# EAGLE design zxuno (EAGLE 7.3.0)
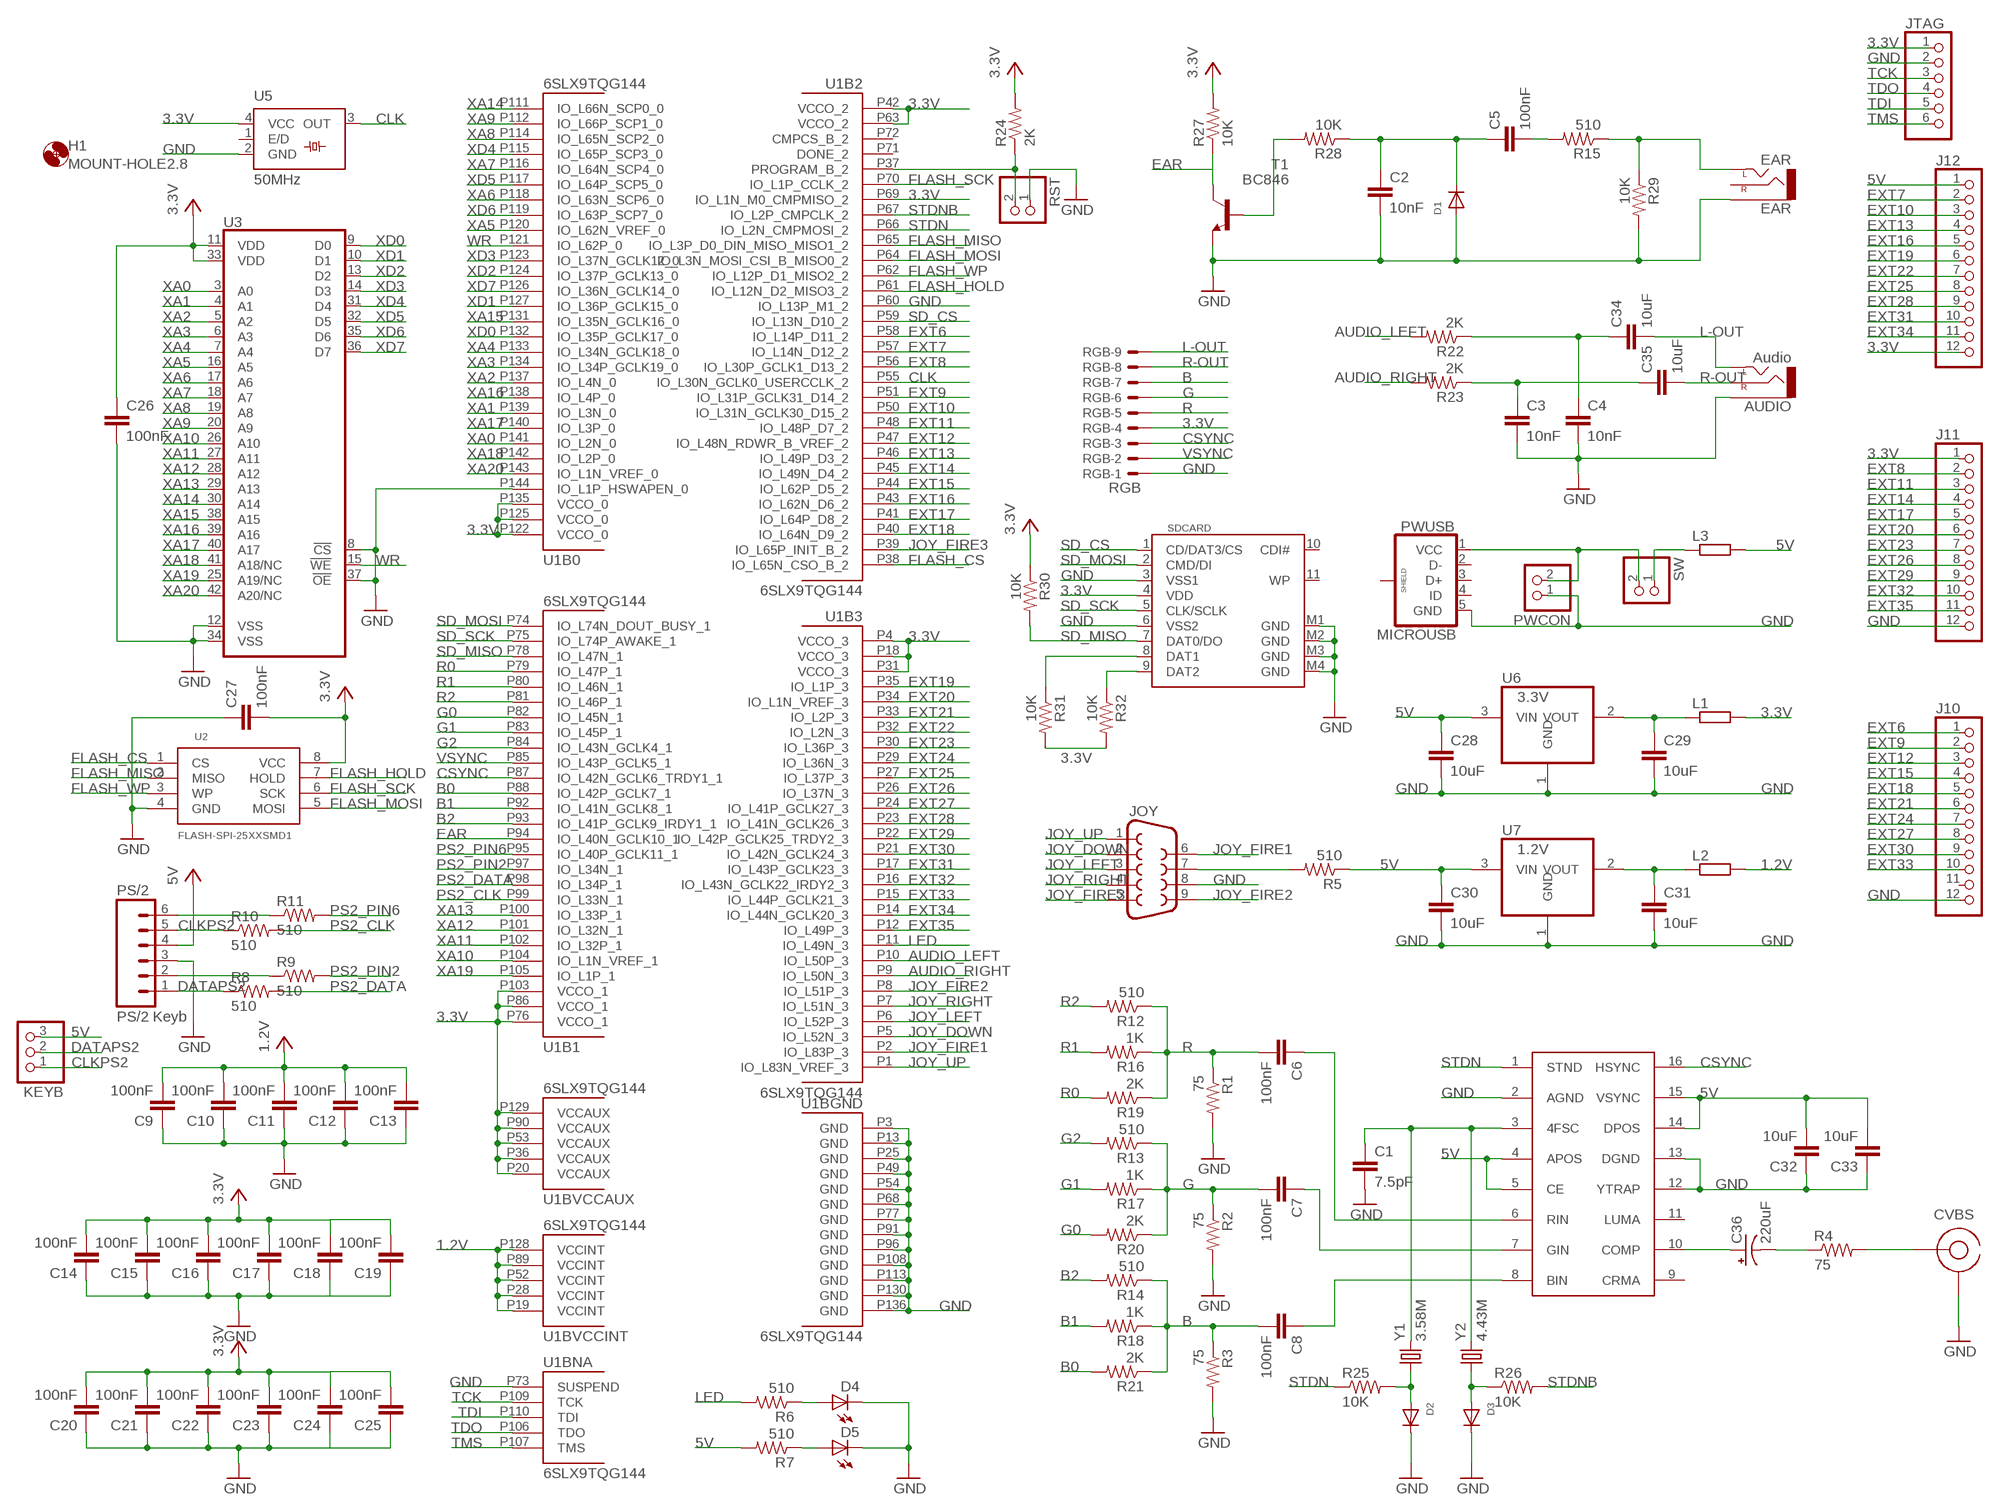
[diagram p0: schematic, sheet 1]

## Parts
AUDIO  Audio  AUDIO-JACKPTH  [AUDIO-JACK]
C1  7.5pF  C-EUC0805  [C0805]
C2  10nF  C-EUC0805  [C0805]
C3  10nF  C-EUC0805  [C0805]
C4  10nF  C-EUC0805  [C0805]
C5  100nF  C-EUC0603  [C0603]
C6  100nF  C-EUC0603  [C0603]
C7  100nF  C-EUC0603  [C0603]
C8  100nF  C-EUC0603  [C0603]
C9  100nF  C-EUC0603  [C0603]
C10  100nF  C-EUC0603  [C0603]
C11  100nF  C-EUC0603  [C0603]
C12  100nF  C-EUC0603  [C0603]
C13  100nF  C-EUC0603  [C0603]
C14  100nF  C-EUC0603  [C0603]
C15  100nF  C-EUC0603  [C0603]
C16  100nF  C-EUC0603  [C0603]
C17  100nF  C-EUC0603  [C0603]
C18  100nF  C-EUC0603  [C0603]
C19  100nF  C-EUC0603  [C0603]
C20  100nF  C-EUC0603  [C0603]
C21  100nF  C-EUC0603  [C0603]
C22  100nF  C-EUC0603  [C0603]
C23  100nF  C-EUC0603  [C0603]
C24  100nF  C-EUC0603  [C0603]
C25  100nF  C-EUC0603  [C0603]
C26  100nF  C-EUC0603  [C0603]
C27  100nF  C-EUC0603  [C0603]
C28  10uF  C-EUC0805  [C0805]
C29  10uF  C-EUC0805  [C0805]
C30  10uF  C-EUC0805  [C0805]
C31  10uF  C-EUC0805  [C0805]
C32  10uF  C-EUC0805  [C0805]
C33  10uF  C-EUC0805  [C0805]
C34  10uF  C-EUC0805  [C0805]
C35  10uF  C-EUC0805  [C0805]
C36  220uF  CPOL-US153CLV-0605  [153CLV-0605]
CVBS  RCA  [RCA]
D1  DIODESOD-323F  [SOD-323F]
D2  DIODESOD-323F  [SOD-323F]
D3  DIODESOD-323F  [SOD-323F]
D4  LEDCHIP-LED0805  [CHIP-LED0805]
D5  LEDCHIP-LED0805  [CHIP-LED0805]
EAR  EAR  AUDIO-JACKPTH  [AUDIO-JACK]
H1  MOUNT-HOLE2.8  [2,8]
J10  PINHD-1X12  [1X12]
J11  PINHD-1X12  [1X12]
J12  PINHD-1X12  [1X12]
JOY  DB9MALE  [DB9_MALE]
JTAG  PINHD-1X6  [1X06]
KEYB  PINHD-1X3  [1X03]
L1  R-EU_M0805  [M0805]
L2  R-EU_M0805  [M0805]
L3  R-EU_M0805  [M0805]
PS/2  PS/2 Keyb  DINC_MIN_TM_6_1  [DINC/MIN_TM/6_1PRIMARY]
PWCON  PINHD-1X2  [1X02]
PWUSB  MICROUSB  [MICRO_USB_1PRIMARY]
R1  75  R-US_M0805  [M0805]
R2  75  R-US_M0805  [M0805]
R3  75  R-US_M0805  [M0805]
R4  75  R-US_M0805  [M0805]
R5  510  R-US_M0805  [M0805]
R6  510  R-US_M0805  [M0805]
R7  510  R-US_M0805  [M0805]
R8  510  R-US_M0805  [M0805]
R9  510  R-US_M0805  [M0805]
R10  510  R-US_M0805  [M0805]
R11  510  R-US_M0805  [M0805]
R12  510  R-US_M0805  [M0805]
R13  510  R-US_M0805  [M0805]
R14  510  R-US_M0805  [M0805]
R15  510  R-US_M0805  [M0805]
R16  1K  R-US_M0805  [M0805]
R17  1K  R-US_M0805  [M0805]
R18  1K  R-US_M0805  [M0805]
R19  2K  R-US_M0805  [M0805]
R20  2K  R-US_M0805  [M0805]
R21  2K  R-US_M0805  [M0805]
R22  2K  R-US_M0805  [M0805]
R23  2K  R-US_M0805  [M0805]
R24  2K  R-US_M0805  [M0805]
R25  10K  R-US_M0805  [M0805]
R26  10K  R-US_M0805  [M0805]
R27  10K  R-US_M0805  [M0805]
R28  10K  R-US_M0805  [M0805]
R29  10K  R-US_M0805  [M0805]
R30  10K  R-US_M0805  [M0805]
R31  10K  R-US_M0805  [M0805]
R32  10K  R-US_M0805  [M0805]
RGB  RGB  53048-09  [53048-09]
RST  PINHD-1X2  [1X02]
SDCARD  SDCARD  [SDCMF-10915W010]
SW  PINHD-1X2  [1X02]
T1  BC846  [SOT23]
U1  6SLX9TQG144  [TQ144]
U2  FLASH-SPI-25XXSMD1  [SO08-EIAJ]
U3  ISSI_SRAM_8BIT  [TSOP44-II]
U4  AD724  AD725  [SO16W]
U5  50MHz  SM_OSC_1  [SM/OSC_1PRIMARY]
U6  3.3V  REG1117  [SOT223]
U7  1.2V  REG1117  [SOT223]
Y1  3.58M  CRYSTALHC49UP  [HC49UP]
Y2  4.43M  CRYSTALHC49UP  [HC49UP]

## Nets
1.2V: C9.2 C10.2 C11.2 C12.2 C13.2 L2.2 U1.P19(BVCCINT:VCCINT) U1.P28(BVCCINT:VCCINT) U1.P52(BVCCINT:VCCINT) U1.P89(BVCCINT:VCCINT) U1.P128(BVCCINT:VCCINT)
3.3V: C14.2 C15.2 C16.2 C17.2 C18.2 C19.2 C20.2 C21.2 C22.2 C23.2 C24.2 C25.2 C26.1 C27.2 J11.1 J12.12 JTAG.1 L1.2 R24.2 R27.2 R30.1 R31.2 R32.2 RGB.4 SDCARD.4(VDD) U1.P4(B3:VCCO_3) U1.P18(B3:VCCO_3) U1.P20(BVCCAUX:VCCAUX) U1.P31(B3:VCCO_3) U1.P36(BVCCAUX:VCCAUX) U1.P42(B2:VCCO_2) U1.P53(BVCCAUX:VCCAUX) U1.P63(B2:VCCO_2) U1.P69(B2:IO_L1N_M0_CMPMISO_2) U1.P76(B1:VCCO_1) U1.P86(B1:VCCO_1) U1.P90(BVCCAUX:VCCAUX) U1.P103(B1:VCCO_1) U1.P122(B0:VCCO_0) U1.P125(B0:VCCO_0) U1.P129(BVCCAUX:VCCAUX) U1.P135(B0:VCCO_0) U2.8(VCC) U3.11(VDD) U3.33(VDD) U5.4(VCC)
5V: C28.1 C30.1 C32.2 C33.2 J12.1 KEYB.3 L3.2 PS/2.4 R5.1 R7.2 U4.4(APOS) U4.5(CE) U4.14(DPOS) U4.15(VSYNC) U6.3(VIN) U7.3(VIN)
AUDIO_LEFT: R22.2 U1.P10(B3:IO_L50P_3)
AUDIO_RIGHT: R23.2 U1.P9(B3:IO_L50N_3)
B: C8.2 R3.1 R14.1 R18.1 R21.1 RGB.7
B0: R21.2 U1.P88(B1:IO_L42P_GCLK7_1)
B1: R18.2 U1.P92(B1:IO_L41N_GCLK8_1)
B2: R14.2 U1.P93(B1:IO_L41P_GCLK9_IRDY1_1)
CLK: U1.P55(B2:IO_L30N_GCLK0_USERCCLK_2) U5.3(OUT)
CLKPS2: KEYB.1 PS/2.5 R10.1
CSYNC: RGB.3 U1.P87(B1:IO_L42N_GCLK6_TRDY1_1) U4.16(HSYNC)
DATAPS2: KEYB.2 PS/2.1 R8.1
EAR: R27.1 T1.3(C) U1.P94(B1:IO_L40N_GCLK10_1)
EXT6: J10.1 U1.P58(B2:IO_L14P_D11_2)
EXT7: J12.2 U1.P57(B2:IO_L14N_D12_2)
EXT8: J11.2 U1.P56(B2:IO_L30P_GCLK1_D13_2)
EXT9: J10.2 U1.P51(B2:IO_L31P_GCLK31_D14_2)
EXT10: J12.3 U1.P50(B2:IO_L31N_GCLK30_D15_2)
EXT11: J11.3 U1.P48(B2:IO_L48P_D7_2)
EXT12: J10.3 U1.P47(B2:IO_L48N_RDWR_B_VREF_2)
EXT13: J12.4 U1.P46(B2:IO_L49P_D3_2)
EXT14: J11.4 U1.P45(B2:IO_L49N_D4_2)
EXT15: J10.4 U1.P44(B2:IO_L62P_D5_2)
EXT16: J12.5 U1.P43(B2:IO_L62N_D6_2)
EXT17: J11.5 U1.P41(B2:IO_L64P_D8_2)
EXT18: J10.5 U1.P40(B2:IO_L64N_D9_2)
EXT19: J12.6 U1.P35(B3:IO_L1P_3)
EXT20: J11.6 U1.P34(B3:IO_L1N_VREF_3)
EXT21: J10.6 U1.P33(B3:IO_L2P_3)
EXT22: J12.7 U1.P32(B3:IO_L2N_3)
EXT23: J11.7 U1.P30(B3:IO_L36P_3)
EXT24: J10.7 U1.P29(B3:IO_L36N_3)
EXT25: J12.8 U1.P27(B3:IO_L37P_3)
EXT26: J11.8 U1.P26(B3:IO_L37N_3)
EXT27: J10.8 U1.P24(B3:IO_L41P_GCLK27_3)
EXT28: J12.9 U1.P23(B3:IO_L41N_GCLK26_3)
EXT29: J11.9 U1.P22(B3:IO_L42P_GCLK25_TRDY2_3)
EXT30: J10.9 U1.P21(B3:IO_L42N_GCLK24_3)
EXT31: J12.10 U1.P17(B3:IO_L43P_GCLK23_3)
EXT32: J11.10 U1.P16(B3:IO_L43N_GCLK22_IRDY2_3)
EXT33: J10.10 U1.P15(B3:IO_L44P_GCLK21_3)
EXT34: J12.11 U1.P14(B3:IO_L44N_GCLK20_3)
EXT35: J11.11 U1.P12(B3:IO_L49P_3)
FLASH_CS: U1.P38(B2:IO_L65N_CSO_B_2) U2.1(CS)
FLASH_HOLD: U1.P61(B2:IO_L12N_D2_MISO3_2) U2.7(HOLD)
FLASH_MISO: U1.P65(B2:IO_L3P_D0_DIN_MISO_MISO1_2) U2.2(MISO)
FLASH_MOSI: U1.P64(B2:IO_L3N_MOSI_CSI_B_MISO0_2) U2.5(MOSI)
FLASH_SCK: U1.P70(B2:IO_L1P_CCLK_2) U2.6(SCK)
FLASH_WP: U1.P62(B2:IO_L12P_D1_MISO2_2) U2.3(WP)
G: C7.2 R2.1 R13.1 R17.1 R20.1 RGB.6
G0: R20.2 U1.P82(B1:IO_L45N_1)
G1: R17.2 U1.P83(B1:IO_L45P_1)
G2: R13.2 U1.P84(B1:IO_L43N_GCLK4_1)
GND: AUDIO.SLEEVE C1.2 C2.2 C3.2 C4.2 C9.1 C10.1 C11.1 C12.1 C13.1 C14.1 C15.1 C16.1 C17.1 C18.1 C19.1 C20.1 C21.1 C22.1 C23.1 C24.1 C25.1 C26.2 C27.1 C28.2 C29.2 C30.2 C31.2 C32.1 C33.1 CVBS.GND D1.A D2.C D3.C D4.C D5.C EAR.SLEEVE J10.12 J11.12 JOY.8 JTAG.2 PS/2.3 PWCON.1 PWUSB.5(GND) R1.2 R2.2 R3.2 R29.2 RGB.1 RST.1 SDCARD.3(VSS1) SDCARD.6(VSS2) SDCARD.M1(GND) SDCARD.M2(GND) SDCARD.M3(GND) SDCARD.M4(GND) T1.2(E) U1.P3(BGND:GND) U1.P13(BGND:GND) U1.P25(BGND:GND) U1.P49(BGND:GND) U1.P54(BGND:GND) U1.P60(B2:IO_L13P_M1_2) U1.P68(BGND:GND) U1.P73(BNA:SUSPEND) U1.P77(BGND:GND) U1.P91(BGND:GND) U1.P96(BGND:GND) U1.P108(BGND:GND) U1.P113(BGND:GND) U1.P130(BGND:GND) U1.P136(BGND:GND) U1.P144(B0:IO_L1P_HSWAPEN_0) U2.4(GND) U3.8(!CS) U3.12(VSS) U3.34(VSS) U3.37(!OE) U4.2(AGND) U4.12(YTRAP) U4.13(DGND) U5.2(GND) U6.1(GND) U7.1(GND)
JOY_DOWN: JOY.2 U1.P5(B3:IO_L52N_3)
JOY_FIRE1: JOY.6 U1.P2(B3:IO_L83P_3)
JOY_FIRE2: JOY.9 U1.P8(B3:IO_L51P_3)
JOY_FIRE3: JOY.5 U1.P39(B2:IO_L65P_INIT_B_2)
JOY_LEFT: JOY.3 U1.P6(B3:IO_L52P_3)
JOY_RIGHT: JOY.4 U1.P7(B3:IO_L51N_3)
JOY_UP: JOY.1 U1.P1(B3:IO_L83N_VREF_3)
L-OUT: AUDIO.TIP(LEFT) C34.2 RGB.9
LED: R6.2 U1.P11(B3:IO_L49N_3)
N$1: PS/2.6 R11.1
N$3: PS/2.2 R9.1
N$5: R24.1 RST.2 U1.P37(B2:PROGRAM_B_2)
N$6: R28.2 T1.1(B)
N$7: C2.1 C5.1 D1.C R28.1
N$8: C5.2 R15.2
N$9: EAR.TIP(LEFT) R15.1 R29.1
N$10: C3.1 C35.1 R23.1
N$11: C4.1 C34.1 R22.1
N$12: PWCON.2 PWUSB.1(VCC) SW.2
N$13: L3.1 SW.1
N$14: C29.1 L1.1 U6.2(VOUT)
N$15: JOY.7 R5.2
N$17: C31.1 L2.1 U7.2(VOUT)
N$18: R31.1 SDCARD.8(DAT1)
N$19: C8.1 U4.8(BIN)
N$20: R32.1 SDCARD.9(DAT2)
N$21: C7.1 U4.7(GIN)
N$22: C6.1 U4.6(RIN)
N$23: C1.1 U4.3(4FSC) Y1.2 Y2.2
N$24: D3.A R26.1 Y2.1
N$25: D2.A R25.2 Y1.1
N$26: C36.+ U4.10(COMP)
N$27: C36.- R4.1
N$28: CVBS.SIG R4.2
N$31: D4.A R6.1
N$32: D5.A R7.1
PS2_CLK: R10.2 U1.P99(B1:IO_L33N_1)
PS2_DATA: R8.2 U1.P98(B1:IO_L34P_1)
PS2_PIN2: R9.2 U1.P97(B1:IO_L34N_1)
PS2_PIN6: R11.2 U1.P95(B1:IO_L40P_GCLK11_1)
R: C6.2 R1.1 R12.1 R16.1 R19.1 RGB.5
R0: R19.2 U1.P79(B1:IO_L47P_1)
R1: R16.2 U1.P80(B1:IO_L46N_1)
R2: R12.2 U1.P81(B1:IO_L46P_1)
R-OUT: AUDIO.RING(RIGHT) C35.2 RGB.8
SD_CS: SDCARD.1(CD/DAT3/CS) U1.P59(B2:IO_L13N_D10_2)
SD_MISO: R30.2 SDCARD.7(DAT0/DO) U1.P78(B1:IO_L47N_1)
SD_MOSI: SDCARD.2(CMD/DI) U1.P74(B1:IO_L74N_DOUT_BUSY_1)
SD_SCK: SDCARD.5(CLK/SCLK) U1.P75(B1:IO_L74P_AWAKE_1)
STDN: R25.1 U1.P66(B2:IO_L2N_CMPMOSI_2) U4.1(STND)
STDNB: R26.2 U1.P67(B2:IO_L2P_CMPCLK_2)
TCK: JTAG.3 U1.P109(BNA:TCK)
TDI: JTAG.5 U1.P110(BNA:TDI)
TDO: JTAG.4 U1.P106(BNA:TDO)
TMS: JTAG.6 U1.P107(BNA:TMS)
VSYNC: RGB.2 U1.P85(B1:IO_L43P_GCLK5_1)
WR: U1.P121(B0:IO_L62P_0) U3.15(!WE)
XA0: U1.P141(B0:IO_L2N_0) U3.3(A0)
XA1: U1.P139(B0:IO_L3N_0) U3.4(A1)
XA2: U1.P137(B0:IO_L4N_0) U3.5(A2)
XA3: U1.P134(B0:IO_L34P_GCLK19_0) U3.6(A3)
XA4: U1.P133(B0:IO_L34N_GCLK18_0) U3.7(A4)
XA5: U1.P120(B0:IO_L62N_VREF_0) U3.16(A5)
XA6: U1.P118(B0:IO_L63N_SCP6_0) U3.17(A6)
XA7: U1.P116(B0:IO_L64N_SCP4_0) U3.18(A7)
XA8: U1.P114(B0:IO_L65N_SCP2_0) U3.19(A8)
XA9: U1.P112(B0:IO_L66P_SCP1_0) U3.20(A9)
XA10: U1.P104(B1:IO_L1N_VREF_1) U3.26(A10)
XA11: U1.P102(B1:IO_L32P_1) U3.27(A11)
XA12: U1.P101(B1:IO_L32N_1) U3.28(A12)
XA13: U1.P100(B1:IO_L33P_1) U3.29(A13)
XA14: U1.P111(B0:IO_L66N_SCP0_0) U3.30(A14)
XA15: U1.P131(B0:IO_L35N_GCLK16_0) U3.38(A15)
XA16: U1.P138(B0:IO_L4P_0) U3.39(A16)
XA17: U1.P140(B0:IO_L3P_0) U3.40(A17)
XA18: U1.P142(B0:IO_L2P_0) U3.41(A18/NC)
XA19: U1.P105(B1:IO_L1P_1) U3.25(A19/NC)
XA20: U1.P143(B0:IO_L1N_VREF_0) U3.42(A20/NC)
XD0: U1.P132(B0:IO_L35P_GCLK17_0) U3.9(D0)
XD1: U1.P127(B0:IO_L36P_GCLK15_0) U3.10(D1)
XD2: U1.P124(B0:IO_L37P_GCLK13_0) U3.13(D2)
XD3: U1.P123(B0:IO_L37N_GCLK12_0) U3.14(D3)
XD4: U1.P115(B0:IO_L65P_SCP3_0) U3.31(D4)
XD5: U1.P117(B0:IO_L64P_SCP5_0) U3.32(D5)
XD6: U1.P119(B0:IO_L63P_SCP7_0) U3.35(D6)
XD7: U1.P126(B0:IO_L36N_GCLK14_0) U3.36(D7)
Unconnected: EAR.RING(RIGHT) J10.11 PWUSB.2(D-) PWUSB.3(D+) PWUSB.4(ID) PWUSB.6(SHIELD) SDCARD.10(CDI#) SDCARD.11(WP) U1.P71(B2:DONE_2) U1.P72(B2:CMPCS_B_2) U4.9(CRMA) U4.11(LUMA) U5.1(E/D)

## Library data of the parts
AUDIO EAR = SparkFun-Connectors:AUDIO-JACK: 3.5mm Audio Jack Simple 3.5mm common PCB mount audio jack. SKU: PRT-08032
C1-C35 = rcl:C-EU: CAPACITOR, European symbol
C36 = rcl:CPOL-US: POLARIZED CAPACITOR, American symbol
CVBS = uzebox:RCA: RCA jack
D1-D3 = adafruit:DIODE: Diode SMADIODE - SMA Surface Mount Package 20V 1A Schottky Diode Digikey: 641-1014-6-ND DO-1N4148 - Through Hole Small Current Diode SOD-123 20V 1 A (.5mV Vf) Schottky Diode - Digikey: MBRX120TPMSCT-ND SOD-323 10V 570mA (.38mV Vf, 3ns) Schottky Diode - Digikey: ZLLS410CT-ND SOD-523 30V 30mA Schottky Diode (RB751S-40TE61) - Digikey: RB751S-40TE61CT-ND SOT23-R/W - SOT23 Package (R = Solder Paste/Reflow Ovens, W = Hand-Soldering) BAT54Film 40V 300mA - Digikey: 497-7162-1-ND
D4 D5 = led:LED: LED OSRAM: - CHIPLED LG R971, LG N971, LY N971, LG Q971, LY Q971, LO R971, LY R971 LH N974, LH R974 LS Q976, LO Q976, LY Q976 LO Q996 - Hyper CHIPLED LW Q18S LB Q993, LB Q99A, LB R99A - SideLED LS A670, LO A670, LY A670, LG A670, LP A670 LB A673, LV A673, LT A673, LW A673 LH A674 LY A675 LS A676, LA A676, LO A676, LY A676, LW A676 LS A679, LY A679, LG A679 - Hyper Micro SIDELED® LS Y876, LA Y876, LO Y876, LY Y876 LT Y87S - SmartLED LW L88C, LW L88S LB L89C, LB L89S, LG L890 LS L89K, LO L89K, LY L89K LS L896, LA L896, LO L896, LY L896 - TOPLED LS T670, LO T670, LY T670, LG T670, LP T670 LSG T670, LSP T670, LSY T670, LOP T670, LYG T670 LG T671, LOG T671, LSG T671 LB T673, LV T673, LT T673, LW T673 LH T674 LS T676, LA T676, LO T676, LY T676, LB T676, LH T676, LSB T676, LW T676 LB T67C, LV T67C, LT T67C, LS T67K, LO T67K, LY T67K, LW E67C LS E67B, LA E67B, LO E67B, LY E67B, LB E67C, LV E67C, LT E67C LW T67C LS T679, LY T679, LG T679 LS T770, LO T770, LY T770, LG T770, LP T770 LB T773, LV T773, LT T773, LW T773 LH T774 LS E675, LA E675, LY E675, LS T675 LS T776, LA T776, LO T776, LY T776, LB T776 LHGB T686 LT T68C, LB T68C - Hyper Mini TOPLED® LB M676 - Mini TOPLED Santana® LG M470 LS M47K, LO M47K, LY M47K Source: http://www.osram.convergy.de LUXEON: - LUMILED® LXK2-PW12-R00, LXK2-PW12-S00, LXK2-PW14-U00, LXK2-PW14-V00 LXK2-PM12-R00, LXK2-PM12-S00, LXK2-PM14-U00 LXK2-PE12-Q00, LXK2-PE12-R00, LXK2-PE12-S00, LXK2-PE14-T00, LXK2-PE14-U00 LXK2-PB12-K00, LXK2-PB12-L00, LXK2-PB12-M00, LXK2-PB14-N00, LXK2-PB14-P00, LXK2-PB14-Q00 LXK2-PR12-L00, LXK2-PR12-M00, LXK2-PR14-Q00, LXK2-PR14-R00 LXK2-PD12-Q00, LXK2-PD12-R00, LXK2-PD12-S00 LXK2-PH12-R00, LXK2-PH12-S00 LXK2-PL12-P00, LXK2-PL12-Q00, LXK2-PL12-R00 Source: www.luxeon.com KINGBRIGHT: KA-3528ASYC Source: www.kingbright.com
H1 = holes:MOUNT-HOLE: MOUNTING HOLE with drill center marker
J10-J12 = pinhead:PINHD-1X12: PIN HEADER
JOY = SparkFun-Connectors:DB9: DB9 Connector Standard DB9 (D-Sub 9) serial connector. Can be used for CAN bus as well as RS485 and RS232. Footprint production proven. Spark Fun Electronics SKU : PRT-00429
JTAG = pinhead:PINHD-1X6: PIN HEADER
KEYB = pinhead:PINHD-1X3: PIN HEADER
L1-L3 = rcl:R-EU_: RESISTOR, European symbol
PS/2 = ZX_UNO_0_14:DINC_MIN_TM_6_1
PWCON RST SW = pinhead:PINHD-1X2: PIN HEADER
PWUSB = zxuno_rev_mcleod:MICROUSB
R1-R32 = rcl:R-US_: RESISTOR, American symbol
RGB = con-molex:53?-09: CONNECTOR wire to board 1.25 mm (.049 inch) pitch header; MPN: 53048-0910; OC_FARNELL: 1012239; OC_NEWARK: 98K9837
SDCARD = zxuno_rev_mcleod:SDCARD: SD card connector KINGFONT SDCMF-10915W010
T1 = transistor:BC846: NPN TRANSISTOR
U1 = xilinx_devices_V6:6SLX9TQG144: Xilinx FPGA: 6SLX9TQG144
U2 = GadgetFactory:FLASH-SPI-25XX: SPI Flash
U3 = GadgetFactory:ISSI_SRAM_8BIT
U4 = ad725:AD725
U5 = ZX_UNO_0_15:SM_OSC_1
U6 U7 = burr-brown:REG1117: 800mA and 1A Low Dropout (LDO) Positive Regulator 1.8V, 2.5V, 2.85V, 3.3V, 5V, and Adj; MPN: REG1117; OC_FARNELL: 1097566; OC_NEWARK: 14P6981
Y1 Y2 = crystal:CRYSTAL: CRYSTAL; OC_FARNELL: unknown; OC_NEWARK: unknown

## Net classes
0 default: clearance 0.205 mm

## Board
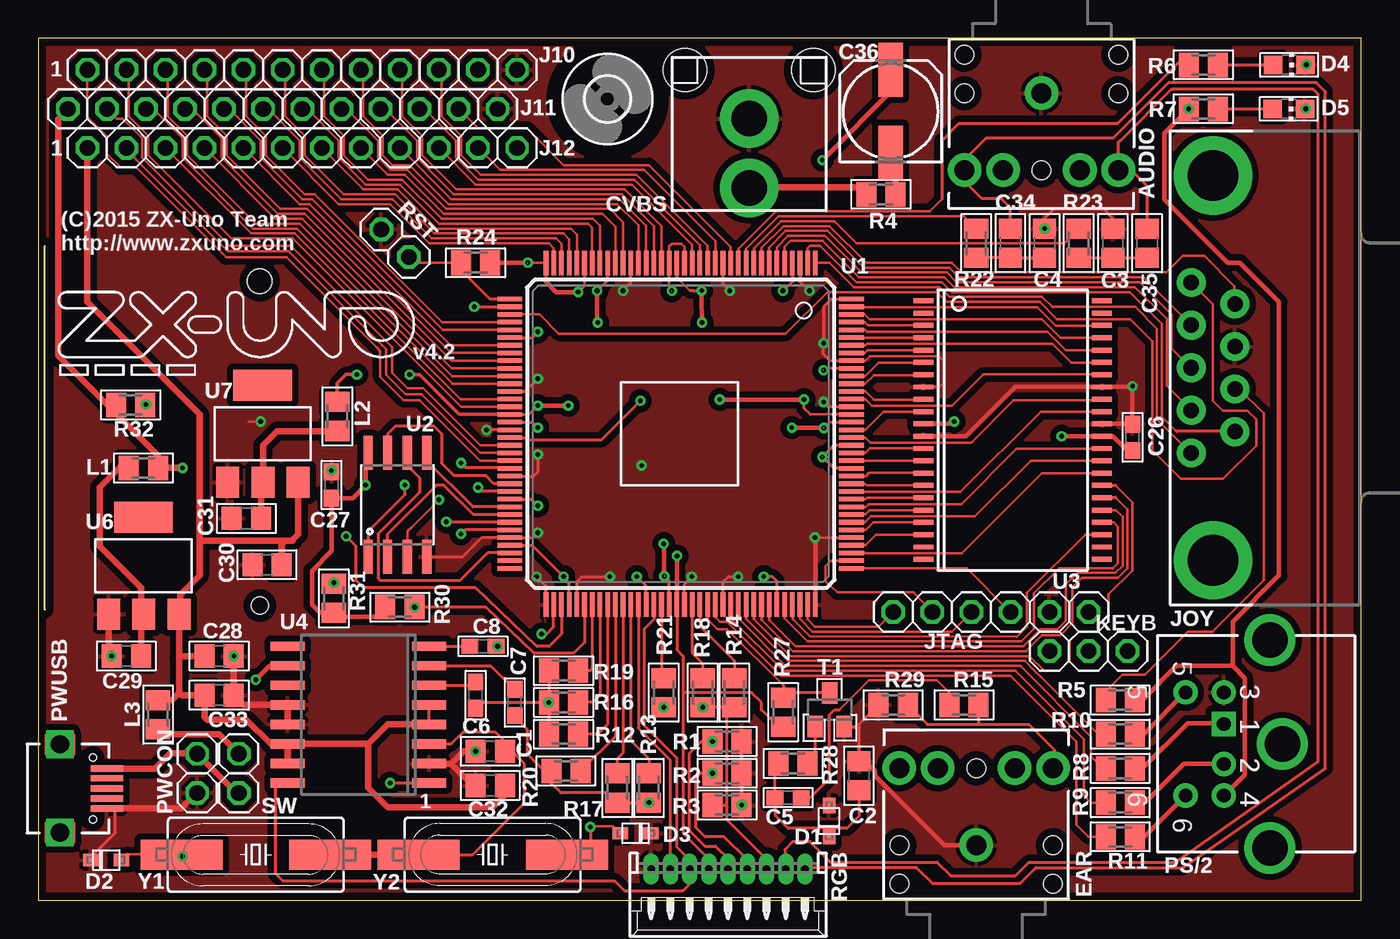
[diagram p1: board, top side]
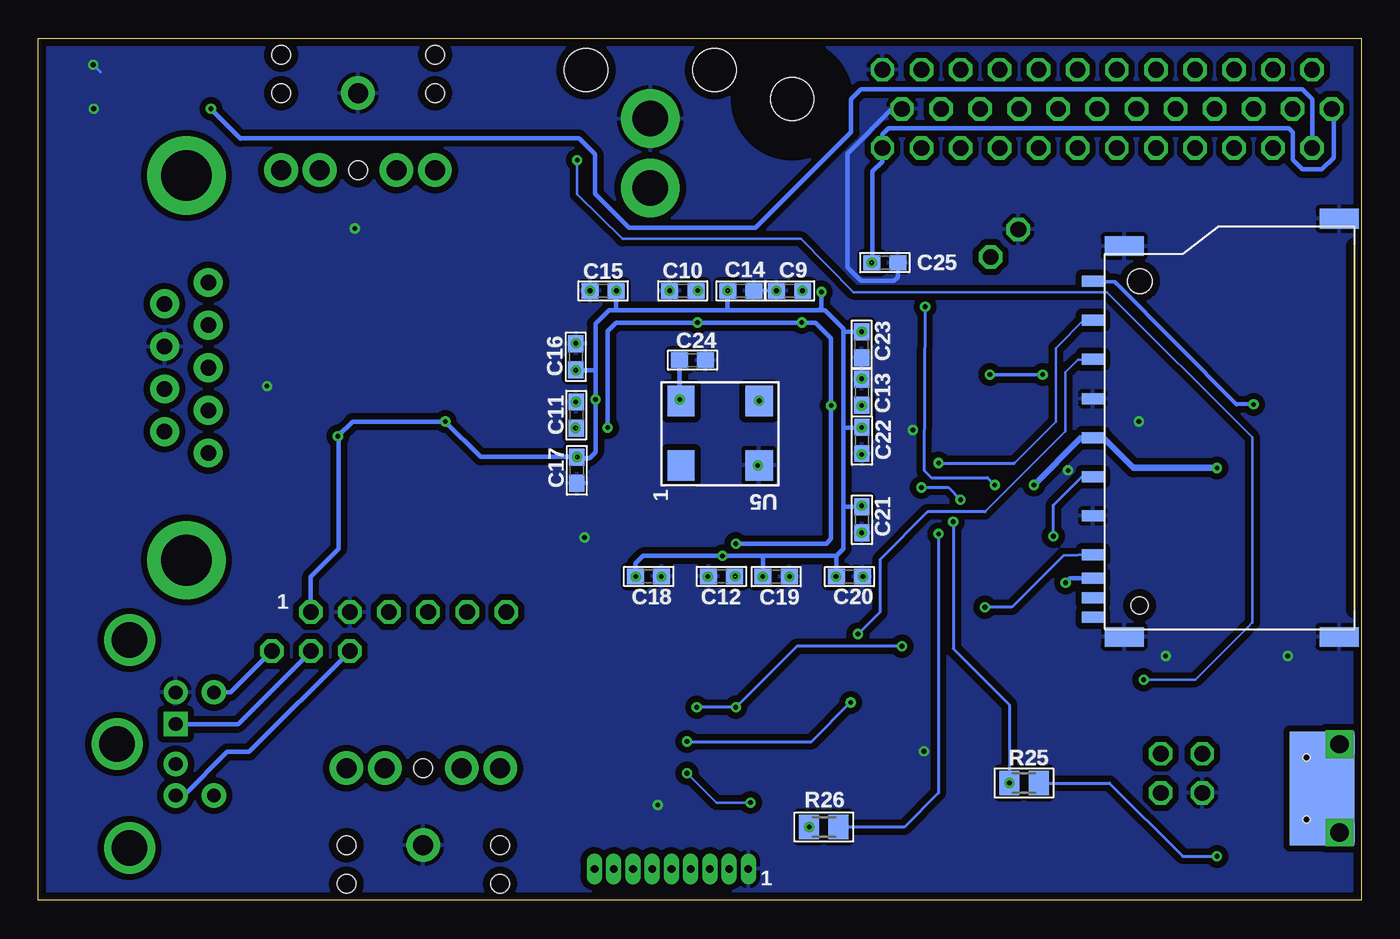
[diagram p2: board, bottom side, seen from below]

Size 85.98 x 56.01 mm. Coordinates in mm from the lower left corner, seen from the top.
Outline: 0,0 85.98,0 85.98,56.01 0,56.01 0,0
Copper layers (1*16): Top 0.035mm / dielectric 1.5mm / Bottom 0.035mm
Design rules "EagleRules": minimum track width 7mil, minimum drill 12mil, track to track 7mil, track to pad 7mil, pad to pad 7mil, via to via 7mil, smd to smd 0mil, copper to edge 20mil, drill to drill 10mil, minimum pad ring 10mil, minimum via ring 6mil, stop-mask expansion 2mil, vias tented up to drill 25mil, thermal gap 10mil

### Footprints (pad centres in the part's own frame; a part is rotated, then mirrored left to right if it is on the bottom)
AUDIO-JACK = drill 1.3 pad 2.184: RING 5,5; RSH 5,2.5; SLEEVE 0,0; TIP 5,-5; TSH 5,-2.5 | hole 1.2: 0,5; -2.5,5; -2.5,-5; 0,-5; 5,0
C0805 = smd 1.3 x 1.5: 1 -0.95,0; 2 0.95,0
C0603 = smd 1.1 x 1: 1 -0.85,0; 2 0.85,0
153CLV-0605 = smd 3.5 x 1.6: + 2.7,0; - -2.7,0
RCA = drill 2.3 pad 3.81: GND 0,0; SIG 0,-4.5 | hole 2.8: -4.175,3.15; 4.175,3.15
SOD-323F = smd 1 x 0.8: A -1,0; C 1,0
CHIP-LED0805 = smd 1.2 x 1.2: A 0,-1.05; C 0,1.05
2,8 = hole 2.8: 0,0
1X12 = drill 1.016 octagon: 1 -13.97,0; 2 -11.43,0; 3 -8.89,0; 4 -6.35,0; 5 -3.81,0; 6 -1.27,0; 7 1.27,0; 8 3.81,0; 9 6.35,0; 10 8.89,0; 11 11.43,0; 12 13.97,0
DB9_MALE = drill 1.016 pad 1.88: 1 5.54,-1.42; 2 2.77,-1.42; 3 0,-1.42; 4 -2.77,-1.42; 5 -5.54,-1.42; 6 4.15,1.42; 7 1.38,1.42; 8 -1.38,1.42; 9 -4.15,1.42 | drill 3.302 pad 5.08: G1 -12.5,0; G2 12.5,0
1X06 = drill 1.016 octagon: 1 -6.35,0; 2 -3.81,0; 3 -1.27,0; 4 1.27,0; 5 3.81,0; 6 6.35,0
1X03 = drill 1.016 octagon: 1 -2.54,0; 2 0,0; 3 2.54,0
M0805 = smd 1.3 x 1.6: 1 -0.95,0; 2 0.95,0
DINC/MIN_TM/6_1PRIMARY = drill 0.889 pad 1.575 square: 1 -1.295,-8.509 | drill 0.889 pad 1.575: 2 1.295,-8.509; 3 -3.353,-8.509; 4 3.353,-8.509; 5 -3.353,-10.998; 6 3.353,-10.998 | drill 2.311 pad 2.845: 7 -6.756,-5.512; 8 0,-4.699; 9 6.756,-5.512
1X02 = drill 1.016 octagon: 1 -1.27,0; 2 1.27,0
MICRO_USB_1PRIMARY = smd 0.406 x 2.108: 1 -1.295,0.381; 2 -0.66,0.381; 3 0,0.381; 4 0.66,0.381; 5 1.295,0.381 | smd 7.366 x 4.191 bottom: 6 0,-1.524 | drill 1.194 pad 1.538 square: 7 -2.87,-2.667; 8 2.87,-2.667 | hole 0.457: -2.007,-0.533; 2.007,-0.533
53048-09 = drill 0.5 pad 0.698 long: 1 5,-1.25; 2 3.75,-1.25; 3 2.5,-1.25; 4 1.25,-1.25; 5 0,-1.25; 6 -1.25,-1.25; 7 -2.5,-1.25; 8 -3.75,-1.25; 9 -5,-1.25
SDCMF-10915W010 = smd 0.711 x 1.422: 1 7.366,13.462; 2 4.826,13.462; 3 2.286,13.462; 4 -0.254,13.462; 5 -2.794,13.462; 6 -5.334,13.462; 7 -7.874,13.462; 8 -9.398,13.462; 9 9.906,13.462; 10 -11.938,13.462; 11 -10.668,13.462 | smd 1.27 x 2.54: M1 12.192,11.43; M2 13.97,-2.54; M3 -13.208,-2.54; M4 -13.208,11.43 | hole 1.6: 9.906,10.414 | hole 1.1: -11.176,10.414
SOT23 = smd 1 x 1.4: 1 -0.95,-1.1; 2 0.95,-1.1; 3 0,1.1
TQ144 = smd 1.6 x 0.3: P1 -11.1,8.75; P2 -11.1,8.25; P3 -11.1,7.75; P4 -11.1,7.25; P5 -11.1,6.75; P6 -11.1,6.25; P7 -11.1,5.75; P8 -11.1,5.25; P9 -11.1,4.75; P10 -11.1,4.25; P11 -11.1,3.75; P12 -11.1,3.25; P13 -11.1,2.75; P14 -11.1,2.25; P15 -11.1,1.75; P16 -11.1,1.25; P17 -11.1,0.75; P18 -11.1,0.25; P19 -11.1,-0.25; P20 -11.1,-0.75; P21 -11.1,-1.25; P22 -11.1,-1.75; P23 -11.1,-2.25; P24 -11.1,-2.75; P25 -11.1,-3.25; P26 -11.1,-3.75; P27 -11.1,-4.25; P28 -11.1,-4.75; P29 -11.1,-5.25; P30 -11.1,-5.75; P31 -11.1,-6.25; P32 -11.1,-6.75; P33 -11.1,-7.25; P34 -11.1,-7.75; P35 -11.1,-8.25; P36 -11.1,-8.75; P73 11.1,-8.75; P74 11.1,-8.25; P75 11.1,-7.75; P76 11.1,-7.25; P77 11.1,-6.75; P78 11.1,-6.25; P79 11.1,-5.75; P80 11.1,-5.25; P81 11.1,-4.75; P82 11.1,-4.25; P83 11.1,-3.75; P84 11.1,-3.25; P85 11.1,-2.75; P86 11.1,-2.25; P87 11.1,-1.75; P88 11.1,-1.25; P89 11.1,-0.75; P90 11.1,-0.25; P91 11.1,0.25; P92 11.1,0.75; P93 11.1,1.25; P94 11.1,1.75; P95 11.1,2.25; P96 11.1,2.75; P97 11.1,3.25; P98 11.1,3.75; P99 11.1,4.25; P100 11.1,4.75; P101 11.1,5.25; P102 11.1,5.75; P103 11.1,6.25; P104 11.1,6.75; P105 11.1,7.25; P106 11.1,7.75; P107 11.1,8.25; P108 11.1,8.75 | smd 0.3 x 1.6: P37 -8.75,-11.1; P38 -8.25,-11.1; P39 -7.75,-11.1; P40 -7.25,-11.1; P41 -6.75,-11.1; P42 -6.25,-11.1; P43 -5.75,-11.1; P44 -5.25,-11.1; P45 -4.75,-11.1; P46 -4.25,-11.1; P47 -3.75,-11.1; P48 -3.25,-11.1; P49 -2.75,-11.1; P50 -2.25,-11.1; P51 -1.75,-11.1; P52 -1.25,-11.1; P53 -0.75,-11.1; P54 -0.25,-11.1; P55 0.25,-11.1; P56 0.75,-11.1; P57 1.25,-11.1; P58 1.75,-11.1; P59 2.25,-11.1; P60 2.75,-11.1; P61 3.25,-11.1; P62 3.75,-11.1; P63 4.25,-11.1; P64 4.75,-11.1; P65 5.25,-11.1; P66 5.75,-11.1; P67 6.25,-11.1; P68 6.75,-11.1; P69 7.25,-11.1; P70 7.75,-11.1; P71 8.25,-11.1; P72 8.75,-11.1; P109 8.75,11.1; P110 8.25,11.1; P111 7.75,11.1; P112 7.25,11.1; P113 6.75,11.1; P114 6.25,11.1; P115 5.75,11.1; P116 5.25,11.1; P117 4.75,11.1; P118 4.25,11.1; P119 3.75,11.1; P120 3.25,11.1; P121 2.75,11.1; P122 2.25,11.1; P123 1.75,11.1; P124 1.25,11.1; P125 0.75,11.1; P126 0.25,11.1; P127 -0.25,11.1; P128 -0.75,11.1; P129 -1.25,11.1; P130 -1.75,11.1; P131 -2.25,11.1; P132 -2.75,11.1; P133 -3.25,11.1; P134 -3.75,11.1; P135 -4.25,11.1; P136 -4.75,11.1; P137 -5.25,11.1; P138 -5.75,11.1; P139 -6.25,11.1; P140 -6.75,11.1; P141 -7.25,11.1; P142 -7.75,11.1; P143 -8.25,11.1; P144 -8.75,11.1
SO08-EIAJ = smd 0.61 x 2.21: 1 -1.905,-3.378; 2 -0.635,-3.378; 3 0.635,-3.378; 4 1.905,-3.378; 5 1.905,3.353; 6 0.635,3.353; 7 -0.635,3.353; 8 -1.905,3.353
TSOP44-II = smd 0.32 x 1.3: 1 -8.4,-5.8; 2 -7.6,-5.8; 3 -6.8,-5.8; 4 -6,-5.8; 5 -5.2,-5.8; 6 -4.4,-5.8; 7 -3.6,-5.8; 8 -2.8,-5.8; 9 -2,-5.8; 10 -1.2,-5.8; 11 -0.4,-5.8; 12 0.4,-5.8; 13 1.2,-5.8; 14 2,-5.8; 15 2.8,-5.8; 16 3.6,-5.8; 17 4.4,-5.8; 18 5.2,-5.8; 19 6,-5.8; 20 6.8,-5.8; 21 7.6,-5.8; 22 8.4,-5.8; 23 8.4,5.8; 24 7.6,5.8; 25 6.8,5.8; 26 6,5.8; 27 5.2,5.8; 28 4.4,5.8; 29 3.6,5.8; 30 2.8,5.8; 31 2,5.8; 32 1.2,5.8; 33 0.4,5.8; 34 -0.4,5.8; 35 -1.2,5.8; 36 -2,5.8; 37 -2.8,5.8; 38 -3.6,5.8; 39 -4.4,5.8; 40 -5.2,5.8; 41 -6,5.8; 42 -6.8,5.8; 43 -7.6,5.8; 44 -8.4,5.8
SO16W = smd 0.6 x 2.2: 1 -4.445,-4.6; 2 -3.175,-4.6; 3 -1.905,-4.6; 4 -0.635,-4.6; 5 0.635,-4.6; 6 1.905,-4.6; 7 3.175,-4.6; 8 4.445,-4.6; 9 4.445,4.6; 10 3.175,4.6; 11 1.905,4.6; 12 0.635,4.6; 13 -0.635,4.6; 14 -1.905,4.6; 15 -3.175,4.6; 16 -4.445,4.6
SM/OSC_1PRIMARY = smd 1.778 x 1.981: 1 0,0; 2 -5.08,0; 3 -5.08,-4.191; 4 0,-4.191
SOT223 = smd 1.499 x 2.007: 1 -2.261,-3.15; 2 0.025,-3.15; 3 2.311,-3.15 | smd 3.81 x 2.007: 4 0,3.15
HC49UP = smd 5.334 x 1.93: 1 -4.826,0; 2 4.826,0

### Placement (x,y rotation side)
AUDIO  65.2,52.45 270 top
C1  29.37,9.68 180 top
C2  53.34,8.1 90 top
C3  69.85,42.7 90 top
C4  65.41,42.7 90 top
C5  48.74,6.67 0 top
C6  28.42,13.34 270 top
C7  30.96,12.86 270 top
C8  28.89,16.51 0 top
C9  37.15,39.61 0 bottom
C10  44.09,39.61 0 bottom
C11  51.02,31.53 270 bottom
C12  41.57,21.05 0 bottom
C13  32.46,33.02 270 bottom
C14  40.3,39.61 180 bottom
C15  49.27,39.61 0 bottom
C16  51.04,35.32 270 bottom
C17  50.98,27.94 90 bottom
C18  46.32,21.05 180 bottom
C19  38.02,21.03 180 bottom
C20  33.26,21.03 180 bottom
C21  32.44,24.73 90 bottom
C22  32.44,29.88 90 bottom
C23  32.46,36.1 90 bottom
C24  43.46,35.1 180 bottom
C25  30.96,41.43 180 bottom
C26  71.12,30.08 90 top
C27  19.05,26.99 270 top
C28  11.75,15.88 0 top
C29  5.71,15.88 180 top
C30  14.86,21.81 180 top
C31  13.53,24.82 180 top
C32  29.37,7.46 0 top
C33  11.75,13.34 180 top
C34  63.18,42.7 90 top
C35  72.07,42.7 90 top
C36  55.41,51.28 90 top
CVBS  46.2,50.8 0 top
D1  51.4,5.16 270 top
D2  4.41,2.62 180 top
D3  38.81,4.36 0 top
D4  81.31,54.3 270 top
D5  81.28,51.44 270 top
EAR  60.96,3.59 90 top
H1  36.99,52.07 0 top
J10  17.14,53.98 0 top
J11  15.88,51.44 0 top
J12  17.14,48.9 0 top
JOY  76.36,34.61 270 top
JTAG  61.92,18.73 180 top
KEYB  68.27,16.2 180 top
L1  6.83,28.1 0 top
L2  19.42,31.45 90 top
L3  7.78,12.06 90 top
PS/2  85.57,10.16 270 top
PWCON  10.32,8.26 90 top
PWUSB  4.06,7.27 270 top
R1  44.77,10.32 0 top
R2  44.77,8.26 0 top
R3  44.77,6.19 0 top
R4  54.77,45.88 180 top
R5  70.33,13.02 180 top
R6  75.72,54.3 180 top
R7  75.72,51.44 180 top
R8  70.33,8.57 180 top
R9  70.33,6.35 180 top
R10  70.33,10.79 180 top
R11  70.33,4.13 180 top
R12  34.13,10.79 0 top
R13  39.69,7.3 90 top
R14  45.24,13.49 90 top
R15  60.17,12.7 180 top
R16  34.13,12.86 0 top
R17  37.62,7.3 90 top
R18  43.18,13.49 90 top
R19  34.13,14.92 0 top
R20  34.29,8.41 0 top
R21  40.64,13.49 90 top
R22  60.96,42.7 90 top
R23  67.63,42.7 90 top
R24  28.42,41.43 0 top
R25  21.91,7.62 0 bottom
R26  34.92,4.76 0 bottom
R27  48.42,12.22 270 top
R28  49.05,8.89 0 top
R29  55.56,12.7 180 top
R30  23.5,19.05 0 top
R31  19.21,19.62 270 top
R32  6,32.19 180 top
RGB  44.83,0.79 180 top
RST  23.18,42.7 315 top
SDCARD  3.97,30.32 90 bottom
SW  13.02,8.26 270 top
T1  51.44,12.38 0 top
U1  41.75,30.32 270 top
U2  23.34,25.72 0 top
U3  63.34,30.56 270 top
U4  20.8,12.06 90 top
U5  44.21,28.26 180 bottom
U6  6.83,21.75 0 top
U7  14.57,30.32 0 top
Y1  14.13,2.97 0 top
Y2  29.53,2.97 180 top

### Tracks (layer width: path | path; a pad name or v marks a point on that pad's centre or on a via)
1.2V  (via drill 0.3 pad 0.66)  (3 unrouted)
  Top 0.178: U1.P28 36.98,40.27 | 41.52,40.43 41.54,40.43 | 42.35,39.63 41.54,40.43 | U1.P19 41.5,40.47 41.54,40.43 | U1.P128 51.43,31.07
  Top 0.203: U1.P89 40.98,20.81 v40.68,21.05 | v43.11,39.62 42.59,39.63 42.35,39.63 | U1.P52 31.89,31.57 v32.46,32.15 | 36.98,40.27 v36.31,39.61 | 51.43,31.07 v51.06,30.7
  Top 0.229: 30.63,31.59 27.34,31.59 24.77,34.16 v24.13,34.16 | L2.2 19.42,33.59 20,34.17 v20.69,34.17 v20.7,34.16
  Top 0.305: 30.63,31.59 U1.P52 | v36.31,39.61 36.31,37.74 v36.35,37.54 | v51.06,30.7 48.99,30.7 v48.97,30.72 | v40.68,21.05 40.68,23.14 v40.64,23.18 | v43.11,39.62 43.11,39.22 v43.13,37.54 | v34.45,32.15 v32.46,32.15
  Bottom 0.203: 36.41,39.49 C9.2
  Bottom 0.229: v24.13,34.16 v20.7,34.16
  Bottom 0.305: v48.97,30.72 48.97,36.99 48.42,37.54 v43.13,37.54 v36.35,37.54 35.48,37.54 34.45,36.51 v34.45,32.15 34.45,23.5 34.77,23.18 v40.64,23.18 | v32.46,32.15 32.49,32.15 C13.2
  Bottom 0.406: C10.2 43.11,39.61 v43.11,39.62
3.3V  (via drill 0.3 pad 0.66)  (5 unrouted)
  Top 0.178: 41,39.82 U1.P20 41,42.49 41.18,42.66 41.81,42.66 42,42.47 U1.P18 | U1.P135 51.16,34.57 | U1.P125 51.72,29.57 | U1.P31 35.5,39.95 | U1.P129 50.19,31.57 | 33,40.18 U1.P36 31.82,41.42
  Top 0.203: U1.P90 41.5,16.28 41.91,15.88 41.91,13.49 | R27.2 48.1,11.27 46.99,12.38 46.99,12.86 46.35,13.49 41.91,13.49 | 41,39.82 v41.18,39.61 | U1.P4 49,40.21 v48.4,39.61 | 51.16,34.57 v51.04,34.45 | U1.P122 51.7,28.07 v50.96,28.81 51.72,29.57 | U1.P103 48,20.74 47.7,21.03 v47.15,21.03 | U1.P86 39.5,20.43 v38.89,21.03 | U1.P76 34.5,20.59 v34.13,21.03 32.09,23.07 U1.P69 | U1.P63 32.03,26.07 v32.46,25.64 | U1.P53 32.11,31.07 v32.46,30.72 | 35.5,39.95 v35.08,39.53 | U1.P42 32.13,36.57 C23.2 | 50.19,31.57 49.77,31.99 v49.77,32.54 | 41.91,13.49 41.91,4.36 43.58,2.69 RGB.4
  Top 0.305: v44.29,32.54 v49.77,32.54 | R24.2 C25.2 31.82,41.42 | C26.1 70.78,29.23 69.85,30.16 U3.33 v66.52,30.16 | v59.53,31.11 59.37,30.96 U3.11 | U1.P90 v41.5,22.37 v41.51,22.38 | U2.8 21.27,28.91 v21.27,26.99 20.42,26.14 C27.2 19.05,22.7 17.78,21.43 17.78,19.21 18.32,18.67 R31.2 19.46,18.41 21.91,18.41 R30.1 | 33,40.18 33.66,39.53 v35.08,39.53
  Top 0.406: J11.1 1.27,50.8 1.27,35.4 4.68,31.99 | 4.68,31.99 7.78,28.89 L1.2 v9.37,28.1 | R32.2 4.89,32.19 4.68,31.99
  Bottom 0.203: C15.2 v48.4,39.61 | C18.2 v47.15,21.03 | v38.89,21.03 C19.2 | v34.13,21.03 C20.2 | v32.46,25.64 32.46,25.59 C21.2 | C22.2 v32.46,30.72
  Bottom 0.305: 35.24,38.34 34.85,38.34 33.66,37.15 33.66,36.99 | 35.24,38.34 41.12,38.34 | 41.12,38.34 48.42,38.34 | 48.42,38.34 48.9,38.34 49.77,37.47 49.77,34.45 | 49.77,34.45 v49.77,32.54 49.77,29.13 50.16,28.73 50.88,28.73 v50.96,28.81 | 38.97,22.38 v41.51,22.38 46.67,22.38 47.15,21.91 47.15,21.07 C18.2 | 38.97,22.38 34.13,22.38 34.11,22.41 | 33.66,25.56 33.66,22.86 34.11,22.41 | 33.66,25.56 33.66,30.72 | 33.66,30.72 33.66,36.99 | v41.18,39.61 41.18,38.4 41.12,38.34 | C15.2 48.42,38.34 | v51.04,34.45 49.77,34.45 | C19.2 38.87,22.28 38.97,22.38 | C20.2 34.11,22.41 | C21.2 33.64,25.57 33.66,25.56 | v32.46,30.72 33.66,30.72 | C24.2 44.31,32.54 U5.4 44.23,32.46 v44.29,32.54 | 31.83,41.45 C25.2 31.75,41.49 31.75,47.37 31.11,48.01 J12.12 31.11,49.78 30.73,50.16 4.7,50.16 4.45,49.91 4.45,48.13 3.81,47.5 2.54,47.5 1.78,48.26 1.78,51.31 J11.1 | C17.2 51,28.81 57.23,28.81 v59.53,31.11 65.56,31.11 v66.52,30.16 66.47,30.11 66.47,22.83 68.27,21.03 JTAG.1 | v35.08,39.53 35.08,38.5 35.24,38.34 | C23.2 33.61,36.95 33.66,36.99
  Bottom 0.406: v9.37,28.1 14.79,28.1 16.72,30.03 SDCARD.4 18.23,30.03 v21.27,26.99 | 31.91,41.53 C25.2
  other vias: 32.46,36.95 31.81,41.43
5V  (via drill 0.3 pad 0.66)
  Top 0.203: U4.5 U4.4 24.45,11.43 | C32.2 30.32,6.98
  Top 0.305: PS/2.4 78.42,8.17 78.42,14.45 77.63,15.24 77.63,15.4 | R7.2 73.18,49.85 73.18,45.56 77.31,41.43 78.11,41.43 80.64,38.89 80.64,21.11 77.63,18.1 77.63,15.4 | 77.63,15.4 77.47,15.24 73.98,15.24 71.75,13.02 R5.1
  Top 0.406: U4.14 U4.15 | 10.88,15.96 C28.1 9.3,15.88 9.14,15.72 | U4.14 15.08,10.16 13.49,11.75 10.95,11.75 10.8,11.9 C33.2 9.3,13.34 9.14,13.49 | J12.1 3.17,38.89 10.48,31.59 10.48,23.35 | 10.48,23.35 10.48,21.11 9.21,19.84 9.21,18.67 U6.3 9.14,15.72 | 9.14,15.72 9.14,13.49 | L3.2 8.66,13.02 9.14,13.49 | U4.14 21.43,10.16 | 21.43,10.16 22.7,11.43 U4.4 | C32.2 30.32,6.82 29.53,6.03 22.7,6.03 21.43,7.3 21.43,10.16 | U7.3 16.89,23.79 16.53,23.43 16.53,23.35 16.03,23.35 | 16.03,23.35 10.48,23.35 | C30.1 15.81,23.13 16.03,23.35
  Bottom 0.305: R7.2 72.83,49.5 72.8,49.53 50.85,49.53 49.8,48.48 49.8,45.91 47.59,43.7 39.36,43.7 33.15,49.91 33.15,52.07 32.51,52.7 3.81,52.7 3.17,52.07 J12.1 | PS/2.4 76.54,6.81 73.71,9.64 72.28,9.64 KEYB.3
  other vias: 74.77,51.44
AUDIO_LEFT
  Top 0.178: U1.P10 46,42.35 48.1,44.45 60.16,44.45 R22.2
AUDIO_RIGHT
  Top 0.178: 66.68,42.7 53.18,42.7 51.75,44.13 48.26,44.13 46.5,42.37 U1.P9
  Top 0.203: 66.68,42.7 R23.2
B  (via drill 0.3 pad 0.66)  (2 unrouted)
  Top 0.203: R18.1 R14.1 44.77,12.07 44.77,6.03 | C8.2 v29.84,16.51 | 44.77,6.03 44.77,5.24 47.33,2.67 RGB.7 | R3.1 44.61,6.19 44.77,6.03
  Bottom 0.203: R18.1 R21.1 36.67,16.51 v29.84,16.51
  other vias: 43.18,12.54 40.64,12.54
B0
  Top 0.203: U1.P88 40.5,14.58 R21.2
B1
  Top 0.203: U1.P92 42.5,16.08 43.18,15.4 R18.2
B2
  Top 0.203: U1.P93 43,17.8 45.24,15.56 R14.2
CLK  (via drill 0.3 pad 0.66)
  Top 0.203: U1.P55 31.76,30.07 31.91,29.92 36.59,29.92 v39.13,32.46
  Bottom 0.203: v39.13,32.46 39.12,32.46 U5.3
CLKPS2
  Top 0.305: R10.1 71.85,10.79 PS/2.5
  Bottom 0.305: PS/2.5 73.49,13.51 KEYB.1
CSYNC
  Top 0.203: U4.16 15.72,7.62 15.4,7.3 15.4,1.75 15.88,1.27 37.47,1.27 38.1,0.64 41.91,0.64 42.29,1.02 42.29,2 RGB.3 42.29,2.08 42.29,2.67 41.48,3.47 41.48,9.27 39.37,11.38 39.37,17.62 40,18.25 U1.P87
DATAPS2
  Top 0.305: R8.1 71.75,8.57 74.71,11.49 76.86,11.49 PS/2.1
  Bottom 0.305: PS/2.1 73.01,11.46 KEYB.2
EAR
  Top 0.178: 43.5,18.25 44.13,17.62 44.77,17.62 48.42,13.97
  Top 0.203: U1.P94 43.5,18.25 | 48.42,13.97 R27.1 48.73,13.48 T1.3
EXT6
  Top 0.178: U1.P58 28.71,28.57 24.77,32.51 23.75,32.51 22.23,34.04 22.23,35.69 21.97,35.94 16.13,41.78 12.19,41.78 11.94,42.04 6.35,47.62 5.33,47.62 4.45,48.51 4.45,49.66 3.17,50.93 J10.1
EXT7
  Top 0.178: U1.P57 28.71,29.07 24.89,32.89 23.88,32.89 22.61,34.16 22.61,35.81 22.35,36.07 16.26,42.16 12.32,42.16 11.81,42.67 6.6,47.88 6.35,48.13 6.22,48.26 6.22,48.39 J12.2
EXT8
  Top 0.178: U1.P56 28.72,29.57 25.02,33.27 24,33.27 22.99,34.29 22.99,35.94 16.38,42.55 12.45,42.55 6.86,48.13 6.73,48.26 6.73,49.53 5.46,50.8 5.08,50.8 J11.2
EXT9
  Top 0.178: J10.2 5.87,53.82 5.87,50.96 7.14,49.69 7.14,48.42 12.54,43.02 16.51,43.02 27.46,32.07 U1.P51
EXT10
  Top 0.178: J12.3 13.81,43.34 16.67,43.34 27.44,32.57 U1.P50
EXT11
  Top 0.178: J11.3 7.46,51.44 9.37,49.53 9.37,48.26 13.97,43.66 16.83,43.66 26.91,33.57 U1.P48
EXT12
  Top 0.178: J10.3 8.41,53.82 8.41,50.96 9.68,49.69 9.68,48.42 14.13,43.97 16.99,43.97 26.89,34.07 U1.P47
EXT13
  Top 0.178: J12.4 15.4,44.29 17.14,44.29 26.86,34.57 U1.P46
EXT14
  Top 0.178: J11.4 10,51.44 11.91,49.53 11.91,48.26 15.56,44.61 17.3,44.61 26.84,35.07 U1.P45
EXT15
  Top 0.178: J10.4 10.95,53.82 10.95,50.96 12.22,49.69 12.22,48.42 15.72,44.93 17.46,44.93 26.82,35.57 U1.P44
EXT16
  Top 0.178: J12.5 16.99,45.24 17.62,45.24 26.79,36.07 U1.P43
EXT17
  Top 0.178: J11.5 12.38,51.44 14.45,49.37 14.45,48.26 17.14,45.56 17.78,45.56 26.27,37.07 U1.P41
EXT18
  Top 0.178: J10.5 13.49,53.82 13.49,50.96 14.76,49.69 14.76,48.42 17.3,45.88 17.94,45.88 26.25,37.57 U1.P40
EXT19
  Top 0.178: U1.P35 33.5,42.38 33.18,42.7 25.4,42.7 22.86,45.24 19.53,45.24 J12.6
EXT20
  Top 0.178: U1.P34 34,42.67 33.66,43.02 25.56,43.02 23.02,45.56 19.68,45.56 16.99,48.26 16.99,49.37 14.92,51.44 J11.6
EXT21
  Top 0.178: U1.P33 34.5,42.97 34.13,43.34 25.72,43.34 23.18,45.88 19.84,45.88 17.3,48.42 17.3,49.69 16.03,50.96 16.03,53.82 J10.6
EXT22
  Top 0.178: U1.P32 35,43.26 34.61,43.66 25.88,43.66 23.34,46.2 21.11,46.2 J12.7
EXT23
  Top 0.178: U1.P30 36,43.69 35.72,43.97 26.04,43.97 23.5,46.51 21.27,46.51 19.53,48.26 19.53,49.37 17.46,51.44 J11.7
EXT24
  Top 0.178: U1.P29 36.5,43.83 36.04,44.29 26.19,44.29 23.65,46.83 21.43,46.83 19.84,48.42 19.84,49.69 18.57,50.96 18.57,53.82 J10.7
EXT25
  Top 0.178: U1.P27 37.5,43.78 36.67,44.61 26.35,44.61 23.81,47.15 22.7,47.15 J12.8
EXT26
  Top 0.178: U1.P26 38,44.07 37.15,44.93 26.51,44.93 23.97,47.47 22.86,47.47 22.07,48.26 22.07,49.37 20,51.44 J11.8
EXT27
  Top 0.178: U1.P24 39,43.87 37.62,45.24 26.67,45.24 24.13,47.78 23.02,47.78 22.38,48.42 22.38,49.69 21.11,50.96 21.11,53.82 J10.8
EXT28
  Top 0.178: U1.P23 39.5,43.84 37.78,45.56 26.83,45.56 J12.9
EXT29
  Top 0.178: U1.P22 40,43.82 37.94,45.88 26.99,45.88 24.61,48.26 24.61,49.37 22.54,51.44 J11.9
EXT30
  Top 0.178: U1.P21 40.5,43.8 38.1,46.2 27.15,46.2 24.92,48.42 24.92,49.69 23.65,50.96 23.65,53.82 J10.9
EXT31
  Top 0.178: U1.P17 42.5,42.59 38.58,46.51 28.42,46.51 J12.10
EXT32
  Top 0.178: U1.P16 43,42.56 38.73,46.83 28.57,46.83 27.15,48.26 27.15,49.37 25.08,51.44 J11.10
EXT33
  Top 0.178: U1.P15 43.5,42.54 38.89,47.15 28.73,47.15 27.46,48.42 27.46,49.69 26.19,50.96 26.19,53.82 J10.10
EXT34
  Top 0.178: U1.P14 44,42.84 39.37,47.47 30,47.47 J12.11
EXT35
  Top 0.178: U1.P12 45,42.47 39.69,47.78 34.13,47.78 31.75,50.16 28.57,50.16 J11.11
FLASH_CS  (via drill 0.3 pad 0.66)
  Top 0.203: v28.34,38.58 U1.P38 | v23.81,26.99 23.81,26.35 21.43,23.97 U2.1
  Bottom 0.203: v28.34,38.58 28.42,27.94 27.94,27.46 24.29,27.46 v23.81,26.99
FLASH_HOLD
  Top 0.203: U1.P61 29.6,27.07 29.05,27.62 26.99,27.62 26.19,28.42 26.19,30.32 25.72,30.8 23.18,30.8 22.7,30.32 U2.7
FLASH_MISO
  Top 0.203: U1.P65 30.64,25.08 28.26,25.08 26.35,26.99 25.88,26.99 22.7,23.81 U2.2
FLASH_MOSI
  Top 0.203: U1.P64 28.25,25.57 25.24,28.57 U2.5 25.26,29.05
FLASH_SCK
  Top 0.203: U1.P70 29.18,22.57 27.41,20.8 22.23,20.8 22.07,20.95 22.07,23.81 24.77,26.51 24.77,27.46 23.97,28.26 U2.6
FLASH_WP  (via drill 0.3 pad 0.66)
  Top 0.178: v26.04,26.04 24.26,24.26 24,24 24,23.21 23.97,23.18
  Top 0.203: 23.97,23.18 U2.3 | U1.P62 28.83,26.57 v28.57,26.83
  Bottom 0.203: v28.57,26.83 26.83,26.83 v26.04,26.04
G  (via drill 0.3 pad 0.66)  (2 unrouted)
  Top 0.203: R13.1 R17.1 36.99,6.99 33.97,6.99 33.34,7.62 R20.1 32.86,8.41 31.75,9.53 31.75,11.11 30.96,11.91 C7.2 | R2.1 43.05,8.26 42.7,7.91 42.7,4.76 43.34,4.13 43.35,4.14 44.56,4.14 46.08,2.62 RGB.6
  Bottom 0.178: R13.1 41.91,6.35 v43.81,8.26
  other vias: 39.69,6.35
G0
  Top 0.203: R20.2 37.5,10.68 U1.P82
G1
  Top 0.203: U1.P83 38,9.59 37.62,9.21 R17.2
G2
  Top 0.203: U1.P84 38.5,10.39 39.69,9.21 R13.2
GND  (via drill 0.3 pad 0.66)
  Top 0.178: 13.65,31.11 v14.44,31.11 | U1.P13 44.5,40.05 | U1.P25 38.5,40.13 | 51.45,35.07 U1.P136 53.76,35.06 54.04,35.35 58.53,35.35 58.88,35 58.88,33.67 58.56,33.36 U3.8 | U1.P144 51.53,39.07 | U1.P130 51.35,32.07 | U1.P113 v50.49,23.57
  Top 0.203: R1.2 R2.2 R3.2 | U2.4 27.58,22.34 28.81,23.57 U1.P68 32.14,23.57 v32.46,23.89 | C1.2 | C32.1 28.26,7.46 | 53.34,11.27 53.34,11.43 R29.2 | T1.2 53.33,11.28 53.34,11.27 | C4.2 v65.41,43.66 65.41,44.29 66.04,44.93 69.22,44.93 69.85,44.29 C3.2 | 71.06,30.96 C26.2 | 44.5,40.05 v44.95,39.61 | U1.P91 42,20.55 v42.47,21.03 | U1.P49 31.62,33.07 v32.46,33.89 | 38.5,40.13 C9.1 | U1.P3 49.5,40.2 C15.1 | 51.53,39.07 51.04,38.58 v51.04,36.2 51.04,35.48 51.45,35.07 | 51.35,32.07 v51.04,32.38 | U1.P96 44.5,20.69 44.85,21.03 v45.48,21.03 | U1.P77 35,20.71 35.32,21.03 v37.15,21.03 | U1.P73 33,20.42 v32.38,21.03 | U1.P54 29.3,30.57 v29.13,30.56 | U1.P60 32.17,27.57 32.46,27.86 v32.46,28.97 | 53.34,11.27 C2.2 | D2.C 3.4,2.81 5,4.41 5,5.97
  Top 0.305: C27.1 v19.05,27.94 | U3.12 60.3,30.16 63.5,33.36 U3.37 71.06,33.36 v71.12,33.42 C26.2 71.09,30.96 U3.34 | U1.P108 50.5,23.48 v50.48,23.57 v50.49,23.57 | C2.2 53.74,9.05 54.37,8.41 54.39,8.1 58.9,3.59 EAR.SLEEVE
  Top 0.406: U4.13 U4.12 13.33,12.7 C33.1 C28.2 | U6.1 4.57,16.07 C29.2 | U4.2 26.83,8.89 | 26.83,8.89 27.62,9.68 C1.2 | 28.26,7.46 26.83,8.89 | 10.32,6.95 PWCON.1 9.28,5.97 5,5.97 PWUSB.5
  Bottom 0.203: 81.95,53.82 v82.42,54.3 | C23.1 v32.46,33.89 | C25.1 30.11,41.27 30.34,41.04 | C9.1 C14.1 | C15.1 | C19.1 v37.15,21.03 | v32.38,21.03 C20.1 | C21.1 v32.46,23.89 | C22.1 32.45,28.99 v32.46,28.97
  Bottom 0.305: C25.1 30.11,40.51 30.35,40.26 32.51,40.26 33.4,41.15 33.4,48.51 30.48,51.44 J11.12
  other vias: 82.39,51.44 45.72,6.19 12.7,15.88 4.76,15.88 28.42,9.68 38,39.61 50.13,39.61 39.21,28.26
  pour Bottom (isolate 0.406): 0.12,55.88 85.86,55.88 85.86,0.1 0.12,0.1
  pour Top (isolate 0.406): 0.12,0.11 85.86,0.11 85.86,55.89 0.12,55.89
JOY_DOWN
  Top 0.178: JOY.2 73.34,33.43 73.34,37.78 71.28,39.85 59.53,39.85 58.9,40.48 53.34,40.48 50.96,42.86 48.9,42.86 48.5,42.47 U1.P5
JOY_FIRE1
  Top 0.178: 73.98,30.48 73.03,31.43 73.03,37.47 70.96,39.53 59.37,39.53 58.74,40.16 53.18,40.16 50.8,42.55 50.16,42.55 50,42.38 U1.P2
  Top 0.203: JOY.6 77.76,30.48 73.98,30.48
JOY_FIRE2
  Top 0.178: U1.P8 47,42.4 48.42,43.81 51.44,43.81 53.82,41.43 59.37,41.43 60.01,40.8 73.31,40.8 74.4,41.88 75.79,41.88 77.76,39.92 77.76,38.73 JOY.9
JOY_FIRE3
  Top 0.178: U1.P39 32.57,38.07 33.81,36.83 48.58,36.83 51.28,39.53 58.42,39.53 59.05,38.89 65.09,38.89 66.22,37.76 70.98,37.76 72.41,36.34 72.41,29.25 74.26,27.4 77.01,27.4 79.16,29.55 79.16,31.26 78.59,31.83 76.98,31.83 76.35,32.46 76.35,38.73 JOY.5
JOY_LEFT
  Top 0.178: JOY.3 73.66,35.89 73.66,38.1 71.6,40.16 59.69,40.16 59.05,40.8 53.5,40.8 51.12,43.18 48.74,43.18 48,42.45 U1.P6
JOY_RIGHT
  Top 0.178: U1.P7 47.5,42.42 48.58,43.5 51.28,43.5 53.66,41.12 59.21,41.12 59.85,40.48 71.83,40.48 JOY.4
JOY_UP
  Top 0.178: 74.75,29.23 72.71,31.27 72.71,37.15 71.3,38.56 65.9,38.56 65.25,39.21 59.21,39.21 58.58,39.85 53.02,39.85 51.44,41.43 50.51,41.43 U1.P1
  Top 0.203: 74.75,29.23 JOY.1
L-OUT
  Top 0.203: C34.2 63.18,45.02 62.61,45.59 61.34,45.59 60.33,46.61 60.33,47.37 AUDIO.TIP 60.33,47.53 60.33,48.26 61.59,49.53 69.85,49.53 73.45,53.13 83.07,53.13 83.66,52.55 83.66,8.57 74.39,2.13 64.83,2.13 63.82,1.11 58.1,1.11 57.09,2.13 49.91,2.13 RGB.9
LED
  Top 0.178: 58.74,45.56 57.94,44.77 47.94,44.77 45.5,42.33 U1.P11
  Top 0.203: 74.45,54.45 R6.2 74.14,54.45 70.17,50.48 59.85,50.48 58.74,49.37 58.74,45.56
N$1
  Top 0.305: R11.1 71.89,4.13 PS/2.6
N$3
  Top 0.305: R9.1 71.91,6.35 74.44,8.89 77.07,8.89 PS/2.2
N$5
  Top 0.178: 26.35,41.43 R24.1 24.45,41.43 RST.2
  Top 0.203: U1.P37 29.35,39.07 27.46,40.96 R24.1
N$6
  Top 0.203: 50.48,8.89 R28.2 50.48,9.05 T1.1
N$7
  Top 0.203: R28.1 47.89,8.67 C5.1 47.89,5.53 48.74,4.68 51.4,4.68 | C2.1 53.34,5.48 52.55,4.68 51.4,4.68 | D1.C 51.4,4.68
N$8
  Top 0.178: 52.07,12.38 53.98,14.29 58.42,14.29 59.21,13.49
  Top 0.203: C5.2 50.16,6.67 51.44,7.94 51.44,12.06 51.75,12.38 52.07,12.38 | 59.21,13.49 R15.2
N$9
  Top 0.203: R29.1 57.78,11.43 61.12,11.43 | 61.12,11.43 64.39,11.43 66.04,9.78 66.04,8.67 EAR.TIP | R15.1 61.12,11.43
N$10
  Top 0.203: R23.1 C3.1 C35.1
N$11
  Top 0.203: C4.1 C34.1 R22.1
N$12
  Top 0.406: SW.2 12.86,6.99 PWCON.2 10.32,9.56 8.56,9.56 7.57,8.57 PWUSB.1
N$13
  Top 0.406: SW.1 11.75,10.79 8.1,10.79 L3.1
N$14
  Top 0.406: U6.2 6.67,18.6 | 6.67,18.6 C29.1 | 6.67,18.6 6.67,20.32 3.97,23.02 3.97,26.83 5.24,28.1 L1.1
N$15
  Top 0.178: JOY.7 78.06,33.23 79.65,31.64 79.65,20.79 76.32,17.46 74.71,17.46 71.92,14.67 70.48,14.67 69.41,13.61 69.41,13.05 R5.2 69.5,13.14
N$17
  Top 0.406: C31.1 14.48,27.05 U7.2 14.6,29.59 15.51,30.5 L2.1
N$18  (via drill 0.3 pad 0.66)
  Top 0.305: R31.1 v19.21,20.64
  Bottom 0.305: v19.21,20.64 18.93,20.91 17.82,20.91 SDCARD.8
N$19
  Top 0.203: U4.8 C8.1
N$20  (via drill 0.3 pad 0.66)
  Top 0.254: v6.99,32.23 7.08,32.07 R32.1
  Bottom 0.254: v6.99,32.23 8.1,32.23 15.91,40.08 16.02,40.19 SDCARD.9
N$21
  Top 0.203: U4.7 29.39,15.24 C7.1
N$22
  Top 0.203: U4.6 28.2,13.97 C6.1
N$23
  Top 0.203: U4.3 26.83,10.16 27.62,10.95 29.69,10.95 30.32,10.32 C1.1 30.8,9.68 31.59,8.89 31.59,6.35 28.21,2.97 Y2.2
  Top 0.406: Y2.2 Y1.2
N$24  (via drill 0.3 pad 0.66)
  Top 0.178: R26.1 35.94,4.83 37.35,4.83 D3.A
  Top 0.203: R26.1 35.88,3.49 35.24,2.86 Y2.1
  Bottom 0.406: R26.1
  other vias: 35.88,4.76
N$25  (via drill 0.3 pad 0.66)
  Top 0.203: v9.37,2.86 Y1.1 5.77,3 D2.A
  Bottom 0.203: R25.2 16.35,7.62 11.59,2.86 v9.37,2.86
N$26  (via drill 0.3 pad 0.66)
  Top 0.305: C36.+ 55.72,52.86 v50.96,48.1 | U4.10 15.04,15.24 v14.13,14.33
  Bottom 0.178: v50.96,48.1 50.96,45.88 48.02,42.98 36.4,42.98 32.99,39.53 16.51,39.53 7.06,30.08 7.06,18.05 7.09,18.03 7.36,17.76 10.78,14.33 v14.13,14.33
N$27
  Top 0.406: R4.1 55.72,48.57 C36.-
N$28
  Top 0.406: R4.2 53.36,46.34 46.27,46.34 CVBS.SIG
N$31
  Top 0.203: R6.1 D4.A
N$32
  Top 0.203: R7.1 D5.A
PS2_CLK
  Top 0.178: 46,18.29 48.74,15.56 64.14,15.56 64.14,15.55 64.85,14.84 65.17,14.52 68.89,10.79 R10.2 68.9,10.79
  Top 0.203: U1.P99 46,18.29
PS2_DATA
  Top 0.178: 45.5,18.32 48.58,15.24 63.82,15.24 68.42,10.64 68.42,9.37 69.22,8.57 R8.2
  Top 0.203: U1.P98 45.5,18.32
PS2_PIN2
  Top 0.178: 45,18.34 48.42,14.92 63.5,14.92 67.94,10.48 67.94,6.83 68.42,6.35 R9.2
  Top 0.203: U1.P97 45,18.34
PS2_PIN6
  Top 0.178: 43.97,18.41 44.29,18.1 44.77,18.1 48.26,14.61 63.18,14.61 67.47,10.32 67.47,4.92 68.26,4.13 R11.2
  Top 0.203: 43.97,18.41 43.97,19.19 U1.P95
R  (via drill 0.3 pad 0.66)  (1 unrouted)
  Top 0.203: R19.1 R16.1 R12.1 R16.1 28.79,12.86 C6.2 | v43.81,10.32 43.08,10.32 42.31,9.55 42.31,4.53 43.32,3.52 44.03,3.52 44.86,2.69 44.86,2.07 RGB.5
  Bottom 0.203: v43.81,10.32 35.72,10.32 R16.1
  other vias: 33.18,12.86
R0
  Top 0.203: U1.P79 36,15.05 35.88,14.92 R19.2
R1
  Top 0.203: U1.P80 36.5,13.32 36.04,12.86 R16.2
R2
  Top 0.203: U1.P81 37,11.44 36.35,10.79 R12.2
R-OUT
  Top 0.203: C35.2 72.07,46.42 70.99,47.5 70.45,47.5 AUDIO.RING 70.2,49.26 70.33,49.37 73.66,52.7 82.87,52.7 83.19,52.39 83.19,9.05 73.91,2.48 64.39,2.48 63.5,1.59 59.31,1.59 58.42,2.48 51.5,2.48 50.16,3.81 49.02,3.81 48.51,3.3 48.51,2.11 RGB.8
SD_CS  (via drill 0.3 pad 0.66)
  Top 0.203: U1.P59 30.62,28.1 27.78,28.1 v27.46,28.42
  Bottom 0.178: 17.65,37.78 17.94,37.78 19.84,35.88 19.84,31.11 22.54,28.42
  Bottom 0.203: v27.46,28.42 22.54,28.42 | SDCARD.1 17.65,37.78
SD_MISO  (via drill 0.3 pad 0.66)  (1 unrouted)
  Top 0.203: U1.P78 35.5,16.77 34.8,16.07 32.23,16.07 29.08,19.05 R30.2
  Bottom 0.203: SDCARD.7 19.34,22.41 22.7,19.05 R30.2
  other vias: 24.45,19.05
SD_MOSI  (via drill 0.3 pad 0.66)
  Top 0.203: v32.7,17.3 33.02,17.3 33.5,17.78 U1.P74
  Bottom 0.178: 24.45,25.24 19.21,30.48 19.21,34.33 18.41,35.12 17.45,35.12 SDCARD.2
  Bottom 0.203: v32.7,17.3 31.27,18.73 31.27,22.15 28.18,25.24 24.45,25.24
SD_SCK  (via drill 0.3 pad 0.66)
  Top 0.203: U1.P75 34,17.33 33.18,16.51 32.38,16.51 28.42,20.32 21.11,20.32 20.64,20.8 20.64,23.02 v20,23.65
  Bottom 0.203: v20,23.65 20,25.68 18.1,27.58 17.53,27.58 SDCARD.5
STDN  (via drill 0.3 pad 0.66)
  Top 0.203: U1.P66 26.55,24.57 v26.51,24.61 | U4.1 R25.1
  Bottom 0.203: v26.51,24.61 26.51,16.36 22.86,12.7 R25.1
  other vias: 22.86,7.62
STDNB  (via drill 0.3 pad 0.66)
  Top 0.203: U1.P67 27.72,24.07 v27.46,23.81
  Bottom 0.203: v27.46,23.81 27.46,6.99 29.69,4.76 R26.2
TCK
  Top 0.178: U1.P109 60.35,21.57 JTAG.3
TDI
  Top 0.178: U1.P110 51.52,22.07 51.16,21.71 51.16,20.75 51.93,20.01 56.87,20.01 JTAG.5
TDO
  Top 0.178: U1.P106 49.5,18.29 50.32,17.46 59.38,17.46 JTAG.4
TMS
  Top 0.178: U1.P107 50,18.26 50.48,17.78 54.62,17.78 JTAG.6
VSYNC
  Top 0.203: U1.P85 39,11.19 40.77,9.41 41.05,9.14 41.08,9.11 RGB.2
WR
  Top 0.178: U3.15 57.52,27.78 53.99,27.78 53.78,27.57 U1.P121
XA0
  Top 0.178: U1.P141 53.72,37.57 53.93,37.37 U3.3
XA1
  Top 0.178: 57.52,36.58 U3.4 U1.P139
XA2
  Top 0.178: U1.P137 52.86,35.56 53.7,35.56 53.9,35.76 U3.5
XA3
  Top 0.178: U3.6 57.51,34.92 54.59,34.92 53.74,34.07 U1.P134
XA4
  Top 0.178: U3.7 57.51,34.13 54.3,34.13 53.74,33.57 U1.P133
XA5
  Top 0.178: U3.16 57.51,26.99 53.82,26.99 53.73,27.07 U1.P120
XA6
  Top 0.178: U3.17 57.47,26.15 53.86,26.15 53.76,26.05 52.87,26.05 U1.P118
XA7
  Top 0.178: U3.18 54.03,25.36 53.76,25.08 52.86,25.08 U1.P116
XA8
  Top 0.178: U1.P114 53.78,24.07 54.27,24.56 U3.19
XA9
  Top 0.178: U1.P112 53.77,23.07 54.46,23.76 U3.20
XA10
  Top 0.178: 69.19,24.61 U3.26 69.9,24.56 70.17,24.29 70.17,21.91 69.85,21.59 66.36,21.59 64.72,19.96 64.72,17.66 63.88,16.83 50.01,16.83 48.5,18.33 U1.P104
XA11
  Top 0.178: U3.27 70.05,25.36 70.48,24.92 70.48,21.75 70.01,21.27 67.57,21.27 67.56,21.28 66.81,20.52 66.81,18.17 66.25,17.62 65.15,17.62 64.04,16.51 49.21,16.51 47.5,18.22
  Top 0.203: U1.P102 47.5,18.22
XA12
  Top 0.178: 70.01,26.19 70.8,25.4 70.8,21.59 70.17,20.95 67.84,20.95 67.84,20.96 67.21,20.34 67.21,18.02 66.42,17.23 65.24,17.23 64.2,16.19 49.05,16.19 47,18.25
  Top 0.203: U3.28 69.18,26.19 70.01,26.19 | U1.P101 47,18.25
XA13
  Top 0.178: 70.01,26.99 71.12,25.88 71.12,21.43 69.56,19.87 69.56,18.13 68.89,17.46 67.64,17.46 67.02,16.84 67.02,15.55 66.38,14.92 65.38,14.92 64.43,15.88 48.9,15.88 46.5,18.27
  Top 0.203: U3.29 69.17,26.99 70.01,26.99 | U1.P100 46.5,18.27
XA14
  Top 0.178: U3.30 65.22,27.76 60.04,22.55 53.74,22.55 53.72,22.57 U1.P111
XA15
  Top 0.178: U1.P131 53.77,32.57 54.19,32.15 59.4,32.15 61.42,34.17 U3.38
XA16
  Top 0.178: U3.39 69.11,34.92 67.16,34.92 65.92,36.16 53.86,36.16 53.77,36.07 U1.P138
XA17
  Top 0.178: U1.P140 52.86,37.08 53.72,37.08 53.86,36.96 65.6,36.96 66.78,35.76 U3.40
XA18
  Top 0.178: U1.P142 53.71,38.07 54.02,37.76 65.25,37.76 66.44,36.57 69.13,36.57 U3.41 69.12,36.58
XA19
  Top 0.178: 49.05,18.26 50.16,17.14 63.61,17.11 64.27,17.78 64.27,19.98 68.05,23.76 U3.25
  Top 0.203: 49.05,18.26 49.05,19.17 U1.P105
XA20
  Top 0.178: U1.P143 53.54,38.58 53.56,38.56 64.94,38.56 66.16,37.34 69.12,37.34 U3.42
XD0
  Top 0.178: U3.9 57.53,32.54 54.3,32.54 53.78,33.07 U1.P132
XD1
  Top 0.178: U3.10 54.93,31.75 53.75,30.57 U1.P127
XD2
  Top 0.178: U3.13 54.05,29.37 53.76,29.07 U1.P124
XD3
  Top 0.178: U1.P123 52.86,28.56 U3.14
XD4
  Top 0.178: U1.P115 53.74,24.57 54.12,24.95 60.89,24.95 64.52,28.57 69.13,28.57 U3.31
XD5
  Top 0.178: U3.32 69.12,29.34 63.57,29.34 59.98,25.75 53.95,25.75 53.76,25.56 52.86,25.56 U1.P117
XD6
  Top 0.178: U3.35 65.15,31.75 59.94,26.54 52.88,26.54 U1.P119
XD7
  Top 0.178: U1.P126 53.77,30.07 54.09,29.75 60.64,29.75 63.39,32.51 69.09,32.51 U3.36

### Text on the board
tPlace: (C)2015 ZX-Uno Team / http://www.zxuno.com | v4.2
tNames: 1 | 1 | 1
bNames: 1 | 1 | 1
_tNames: C36 | R6 | J10 | D4 | R7 | J11 | D5 | J12 | CVBS | C34 | R23 | AUDIO | RST | R4 | R24 | U1 | R22 | C4 | C3 | C35 | U7 | R32 | L2 | C26 | U2 | L1 | U6 | C31 | C27 | C30 | R31 | U3 | U4 | R21 | R14 | R30 | JOY | C28 | C8 | C7 | R18 | C29 | R27 | T1 | R29 | R15 | R19 | R5 | L3 | PWUSB | C33 | R16 | R13 | R10 | C6 | C1 | R12 | R1 | R28 | R8 | R20 | R2 | R9 | PWCON | SW | R3 | C2 | C32 | R17 | D3 | C5 | D1 | RGB | EAR | R11 | PS/2 | D2 | Y1 | Y2
_bNames: C25 | C14 | C9 | C10 | C15 | C23 | C24 | C16 | C13 | C22 | C11 | C17 | C21 | U5 | C20 | C19 | C18 | C12 | R25 | R26